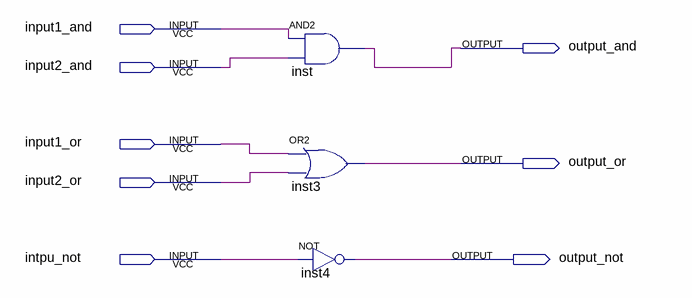
[diagram p0: schematic sheet]
// Quartus schematic Multivibrator.bdf as structural Verilog: 3 symbols, 8 pins
module Multivibrator (
  input  input1_and,
  input  input2_and,
  input  input1_or,
  input  input2_or,
  input  intpu_not,
  output output_and,
  output output_or,
  output output_not
);

  and inst (output_and, input1_and, input2_and);
  or inst3 (output_or, input1_or, input2_or);
  not inst4 (output_not, intpu_not);
endmodule
